# Altium schematic sheet ethernet.SchDoc: Ethernet
size 419 x 297 mm; Address6: Project_Address6; CompanyName: NOT USED; DocumentNumber: 24; SheetNumber: 24; SheetTotal: 29; PageSetup: Record=PageOptions|CenterHorizontal=True|CenterVertical=True|PrintScale=1.00|XCorrection=1.00|YCorrection=1.00|PrintKind=0|BorderSize=5000000|LeftOffset=0|BottomOffset=0|Orientation=2|PaperLength=1000|PaperWidth=1000|Scale=100|PaperSource=7|PrintQuality=-4|MediaType=1|DitherType=10|PaperKind=A3|PrintScaleMode=0
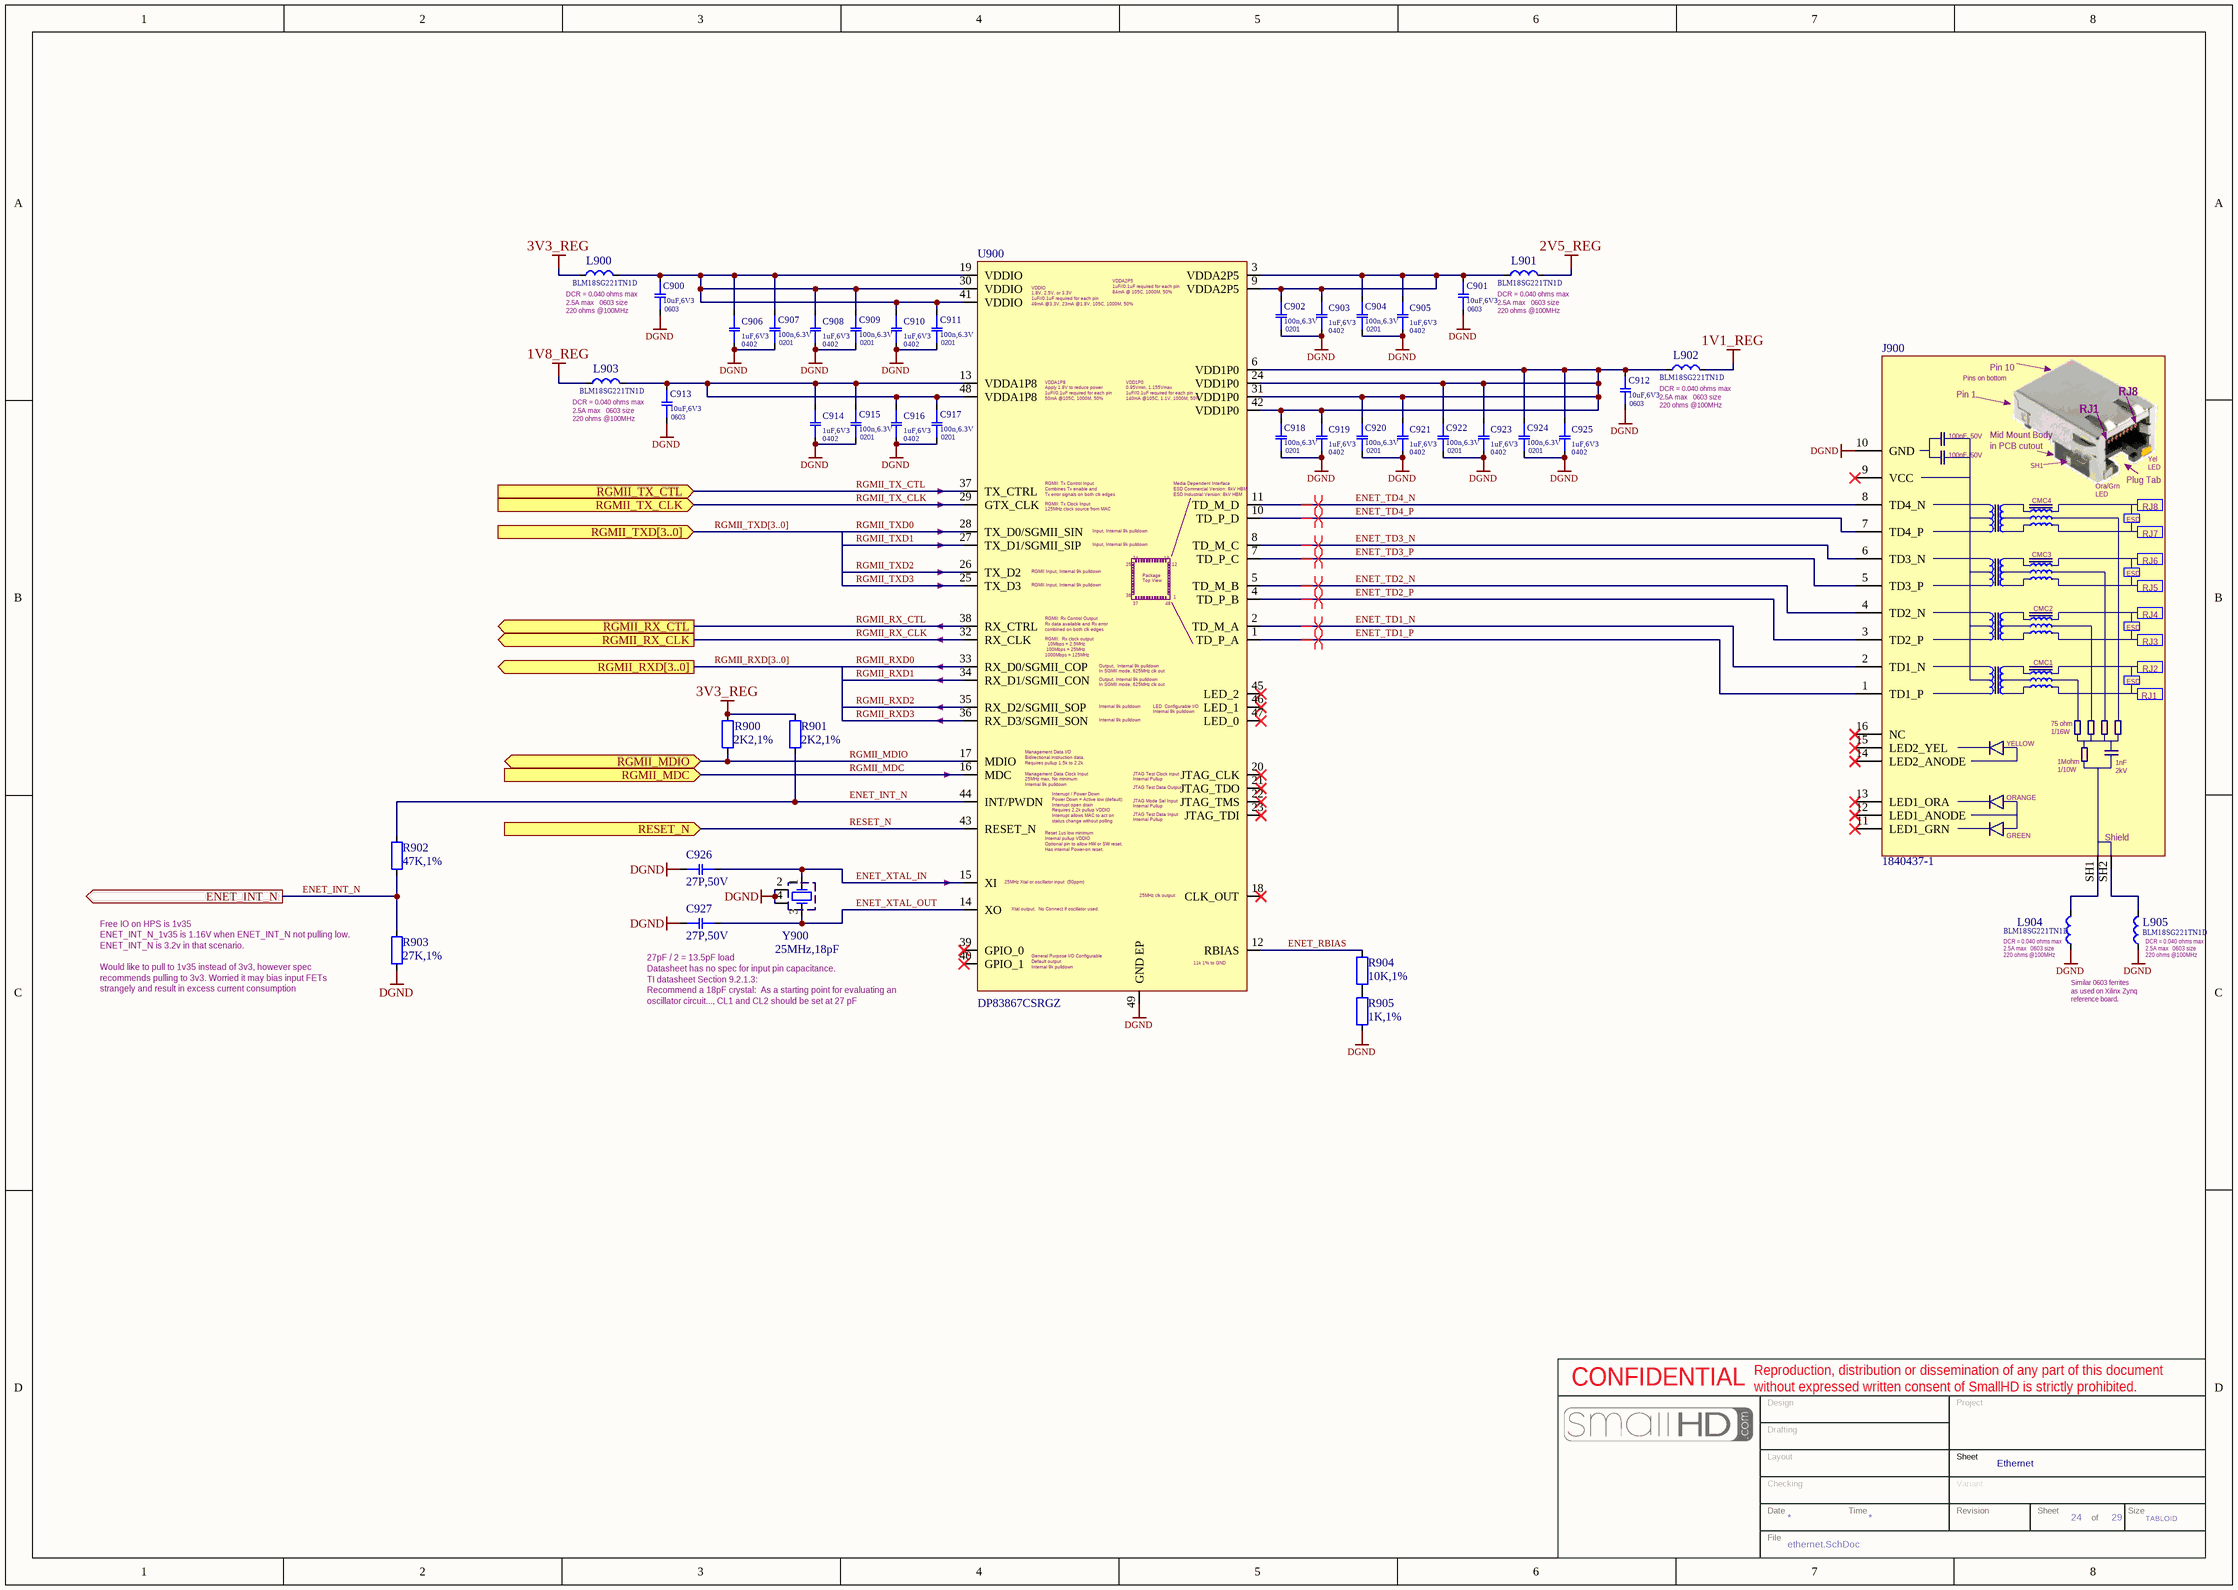
[diagram p0: ethernet.SchDoc]

## Parts
C900  10uF,6V3  Display Footprint: 0603  [CAPC1608X10N_0603]
C901  10uF,6V3  Display Footprint: 0603  [CAPC1608X10N_0603]
C902  100n,6.3V  Display Footprint: 0201  [CAPC0603X03L_0201]
C903  1uF,6V3  Display Footprint: 0402  [CAPC1005X06N_0402]
C904  100n,6.3V  Display Footprint: 0201  [CAPC0603X03L_0201]
C905  1uF,6V3  Display Footprint: 0402  [CAPC1005X06N_0402]
C906  1uF,6V3  Display Footprint: 0402  [CAPC1005X06N_0402]
C907  100n,6.3V  Display Footprint: 0201  [CAPC0603X03L_0201]
C908  1uF,6V3  Display Footprint: 0402  [CAPC1005X06N_0402]
C909  100n,6.3V  Display Footprint: 0201  [CAPC0603X03L_0201]
C910  1uF,6V3  Display Footprint: 0402  [CAPC1005X06N_0402]
C911  100n,6.3V  Display Footprint: 0201  [CAPC0603X03L_0201]
C912  10uF,6V3  Display Footprint: 0603  [CAPC1608X10N_0603]
C913  10uF,6V3  Display Footprint: 0603  [CAPC1608X10N_0603]
C914  1uF,6V3  Display Footprint: 0402  [CAPC1005X06N_0402]
C915  100n,6.3V  Display Footprint: 0201  [CAPC0603X03L_0201]
C916  1uF,6V3  Display Footprint: 0402  [CAPC1005X06N_0402]
C917  100n,6.3V  Display Footprint: 0201  [CAPC0603X03L_0201]
C918  100n,6.3V  Display Footprint: 0201  [CAPC0603X03L_0201]
C919  1uF,6V3  Display Footprint: 0402  [CAPC1005X06N_0402]
C920  100n,6.3V  Display Footprint: 0201  [CAPC0603X03L_0201]
C921  1uF,6V3  Display Footprint: 0402  [CAPC1005X06N_0402]
C922  100n,6.3V  Display Footprint: 0201  [CAPC0603X03L_0201]
C923  1uF,6V3  Display Footprint: 0402  [CAPC1005X06N_0402]
C924  100n,6.3V  Display Footprint: 0201  [CAPC0603X03L_0201]
C925  1uF,6V3  Display Footprint: 0402  [CAPC1005X06N_0402]
C926  27P,50V  [CAPC0603X03L_0201]
C927  27P,50V  [CAPC0603X03L_0201]
J900  1840437-1  [BEL_1840437-1]
L900  BLM18SG221TN1D​  [INDC1608X10N_0603]
L901  BLM18SG221TN1D​  [INDC1608X10N_0603]
L902  BLM18SG221TN1D​  [INDC1608X10N_0603]
L903  BLM18SG221TN1D​  [INDC1608X10N_0603]
L904  BLM18SG221TN1D​  [INDC1608X10N_0603]
L905  BLM18SG221TN1D​  [INDC1608X10N_0603]
R900  2K2,1%  [RESC1005X04N_0402]
R901  2K2,1%  [RESC1005X04N_0402]
R902  47K,1%  [RESC1005X04N_0402]
R903  27K,1%  [RESC1005X04N_0402]
R904  10K,1%  [RESC1005X04N_0402]
R905  1K,1%  [RESC1005X04N_0402]
U900  DP83867CSRGZ  [QFN50P700X700X100_HS-49N]
Y900  25MHz,18pF  [XTAL_ABM8]

## Ports
ENET_INT_N (out), RESET_N (in), RGMII_MDC (in), RGMII_MDIO (bidir), RGMII_RX_CLK (out), RGMII_RX_CTL (out), RGMII_RXD[3..0] (out), RGMII_TX_CLK (in), RGMII_TX_CTL (in), RGMII_TXD[3..0] (in)

## Nets
1V1_REG: L902.2
1V8_REG: L903.1
2V5_REG: L901.2
3V3_REG: L900.1 R900.2 R901.2
DGND: C900.1 C901.1 C902.1 C903.1 C904.1 C905.1 C906.1 C907.1 C908.1 C909.1 C910.1 C911.1 C912.1 C913.1 C914.1 C915.1 C916.1 C917.1 C918.1 C919.1 C920.1 C921.1 C922.1 C923.1 C924.1 C925.1 C926.1 C927.1 J900.10(GND) L904.1 L905.1 R903.1 R905.2 U900.49(GND_EP) Y900.2 Y900.4
ENET_INT_N: R901.1 R902.1 R902.2 R903.2 U900.44(INT/PWDN) ; port ENET_INT_N
ENET_RBIAS: R904.2 U900.12(RBIAS)
ENET_TD1_N: J900.2(TD1_N) U900.2(TD_M_A)
ENET_TD1_P: J900.1(TD1_P) U900.1(TD_P_A)
ENET_TD2_N: J900.4(TD2_N) U900.5(TD_M_B)
ENET_TD2_P: J900.3(TD2_P) U900.4(TD_P_B)
ENET_TD3_N: J900.6(TD3_N) U900.8(TD_M_C)
ENET_TD3_P: J900.5(TD3_P) U900.7(TD_P_C)
ENET_TD4_N: J900.8(TD4_N) U900.11(TD_M_D)
ENET_TD4_P: J900.7(TD4_P) U900.10(TD_P_D)
ENET_XTAL_IN: C926.2 U900.15(XI) Y900.1
ENET_XTAL_OUT: C927.2 U900.14(XO) Y900.3
RESET_N: U900.43(RESET_N) ; port RESET_N
RGMII_MDC: U900.16(MDC) ; port RGMII_MDC
RGMII_MDIO: R900.1 U900.17(MDIO) ; port RGMII_MDIO
RGMII_RX_CLK: U900.32(RX_CLK) ; port RGMII_RX_CLK
RGMII_RX_CTL: U900.38(RX_CTRL) ; port RGMII_RX_CTL
RGMII_RXD0: U900.33(RX_D0/SGMII_COP)
RGMII_RXD1: U900.34(RX_D1/SGMII_CON)
RGMII_RXD2: U900.35(RX_D2/SGMII_SOP)
RGMII_RXD3: U900.36(RX_D3/SGMII_SON)
RGMII_TX_CLK: U900.29(GTX_CLK) ; port RGMII_TX_CLK
RGMII_TX_CTL: U900.37(TX_CTRL) ; port RGMII_TX_CTL
RGMII_TXD0: U900.28(TX_D0/SGMII_SIN)
RGMII_TXD1: U900.27(TX_D1/SGMII_SIP)
RGMII_TXD2: U900.26(TX_D2)
RGMII_TXD3: U900.25(TX_D3)
NetC900_2: C900.2 C906.2 C907.2 C908.2 C909.2 C910.2 C911.2 L900.2 U900.19(VDDIO) U900.30(VDDIO) U900.41(VDDIO)
NetC901_2: C901.2 C902.2 C903.2 C904.2 C905.2 L901.1 U900.3(VDDA2P5) U900.9(VDDA2P5)
NetC912_2: C912.2 C918.2 C919.2 C920.2 C921.2 C922.2 C923.2 C924.2 C925.2 L902.1 U900.6(VDD1P0) U900.24(VDD1P0) U900.31(VDD1P0) U900.42(VDD1P0)
NetC913_2: C913.2 C914.2 C915.2 C916.2 C917.2 L903.2 U900.13(VDDA1P8) U900.48(VDDA1P8)
NetJ900_SH1: J900.SH1(A) L904.2
NetJ900_SH2: J900.SH2(A) L905.2
NetR904_1: R904.1 R905.1

Not connected (* = marked no-connect by the designer): J900 9(VCC)* 11(LED1_GRN)* 12(LED1_ANODE)* 13(LED1_ORA)* 14(LED2_ANODE)* 15(LED2_YEL)* 16(NC)*; U900 18(CLK_OUT)* 20(JTAG_CLK)* 21(JTAG_TDO)* 22(JTAG_TMS)* 23(JTAG_TDI)* 39(GPIO_0)* 40(GPIO_1)* 45(LED_2)* 46(LED_1)* 47(LED_0)*

## Buses and harness runs
bus RGMII_RXD[3..0] = port RGMII_RXD[3..0]
bus RGMII_TXD[3..0] = port RGMII_TXD[3..0]

## Layout directives
differential pair: ENET_TD1_N, ENET_TD1_P, ENET_TD2_N, ENET_TD2_P, ENET_TD3_N, ENET_TD3_P, ENET_TD4_N, ENET_TD4_P

## Notes on the sheet
- DCR = 0.040 ohms max
  2.5A max   0603 size
  220 ohms @100MHz
- (near L901) DCR = 0.040 ohms max
  2.5A max   0603 size
  220 ohms @100MHz
- (near L902) DCR = 0.040 ohms max
  2.5A max   0603 size
  220 ohms @100MHz
- (near L904) DCR = 0.040 ohms max
  2.5A max   0603 size
  220 ohms @100MHz
- Similar 0603 ferrites
  as used on Xilinx Zynq
  reference board.
- (near L905) DCR = 0.040 ohms max
  2.5A max   0603 size
  220 ohms @100MHz
- Free IO on HPS is 1v35
  ENET_INT_N_1v35 is 1.16V when ENET_INT_N not pulling low. ENET_INT_N is 3.2v in that scenario.
  Would like to pull to 1v35 instead of 3v3, however spec recommends pulling to 3v3. Worried it may bias input FETs strangely and result in excess current consumption
- (near C927) 27pF / 2 = 13.5pF load
  Datasheet has no spec for input pin capacitance.
  TI datasheet Section 9.2.1.3:
  Recommend a 18pF crystal:  As a starting point for evaluating an oscillator circuit..., CL1 and CL2 should be set at 27 pF
- CONFIDENTIAL
- Reproduction, distribution or dissemination of any part of this document without expressed written consent of SmallHD is strictly prohibited.
- Design
- Project
- Drafting
- Layout
- Sheet
- Date
- File
- Checking
- Time
- Variant
- Revision
- of
- Size
- TABLOID
- (in symbol 119) Pin 10; Pins on bottom; Pin 1; RJ8; RJ1; 100nF, 50V; Mid Mount Body / in PCB cutout; Yel / LED; Plug Tab; Ora/Grn / LED; CMC4; ESD; RJ7; CMC3; RJ6; RJ5; CMC2; RJ4; RJ3; CMC1; RJ2; 75 ohm / 1/16W; YELLOW; 1Mohm / 1/10W; 1nF / 2kV; ORANGE; GREEN; Shield
- (in symbol ICT-20164-101) VDDA2P5 / 1uF//0.1uF required for each pin / 84mA @ 105C, 1000M, 50%; VDDIO / 1.8V, 2.5V, or 3.3V / 1uF//0.1uF required for each pin / 49mA @3.3V, 23mA @1.8V, 105C, 1000M, 50%; VDDA1P8 / Apply 1.8V to reduce power / 1uF//0.1uF required for each pin / 50mA @105C, 1000M, 50%; VDD1P0 / 0.95Vmin, 1.155Vmax / 1uF//0.1uF required for each pin / 140mA @105C, 1.1V, 1000M, 50%; RGMII: Tx Control Input / Combines Tx enable and / Tx error signals on both clk edges; Media Dependent Interface / ESD Commercial Version: 6kV HBM / ESD Industrial Version: 8kV HBM; RGMII: Tx Clock Input / 125MHz clock source from MAC; Input, Internal 9k pulldown; RGMII Input, Internal 9k pulldown; Package / Top View; RGMII: Rx Control Output / Rx data available and Rx error / combined on both clk edges; RGMII:  Rx clock output / 10Mbps = 2.5MHz / 100Mbps = 25MHz / 1000Mbps = 125MHz; Output,  Internal 9k pulldown / In SGMII mode, 625MHz clk out; Output, Internal 9k pulldown / In SGMII mode, 625MHz clk out; Internal 9k pulldown; LED  Configurable I/O / Internal 9k pulldown; Management Data I/O / Bidirectional instruction data. / Requires pullup 1.5k to 2.2k; JTAG Test Clock input / Internal Pullup; Management Data Clock Input / 25MHz max, No minimum / Internal 9k pulldown; JTAG Test Data Output; JTAG Mode Sel Input / Internal Pullup; JTAG Test Data Input / Internal Pullup; Interrupt / Power Down / Power Down = Active low (default) / Interrupt open drain / Requires 2.2k pullup VDDIO / Interrupt allows MAC to act on / status change without polling; Reset 1us low minimum / Internal pullup VDDIO / Optional pin to allow HW or SW reset. / Has internal Power-on reset.; 25MHz Xtal or oscillator input  (50ppm); 25MHz clk output; Xtal output.  No Connect if oscillator used.; General Purpose I/O Configurable / Default output / Internal 9k pulldown; 11k 1% to GND

## Library data of the parts
C900 C901 C912 C913 = CAP-20026-101: CAP CER 10UF 6.3V 20% X5R 0603; Manufacturer: TDK; Manufacturer Part Number: C1608X5R0J106M080AB; Manufacturer-2 Part Number: GRM188R60J106ME47J; Capacitance: 0.1uF; Type: Ceramic; Display_Name: 10uF,6V3; Dielectric: X5R; Tolerance: 20%; Voltage: 6.3V; Schematic Symbol: CAP-NP_1; smallHD PN: CAP-20026-101; Manufacturer-2: Murata
C902 C904 C907 C909 C911 C915 C917 C918 C920 C922 C924 = CAP-20025-101: CAP CER 0.1UF 6.3V 20% X5R 0201; Manufacturer: TDK; Manufacturer Part Number: C0603X5R0J104M030BC; Manufacturer-2 Part Number: GRM033R60J104ME19D; Type: Ceramic; Display_Name: 100n,6.3V; Capacitance: 0.1uF; Dielectric: X5R; Tolerance: 20%; Voltage: 6.3V; Schematic Symbol: CAP-NP_1; smallHD PN: CAP-20025-101; Manufacturer-2: Murata
C903 C905 C906 C908 C910 C914 C916 C919 C921 C923 C925 = CAP-20023-101: CAP CER 1UF 6.3V 10% X5R 0402; Manufacturer: AVX; Manufacturer Part Number: 04026D105KAT2A; Manufacturer-2 Part Number: GRM155R60J105KE19D; Capacitance: 1.0uF; Type: Ceramic; Display_Name: 1uF,6V3; Dielectric: X5R; Tolerance: 10%; Voltage: 6.3V; Schematic Symbol: CAP-NP_1; smallHD PN: CAP-20023-101; Thickness (Max): 0.56mm; Manufacturer-2: Murata
C926 C927 = CAP-20048-001: CAP CER 27PF 50V 5% NPO 0201; Manufacturer: Murata; Manufacturer Part Number: GRM0335C1H270JA01D; Type: Ceramic; Display Footprint: 0201; Display_Name: 27P,50V; Capacitance: 27PF; Dielectric: NPO; Tolerance: 5%; Voltage: 50V; Schematic Symbol: CAP-NP_1; smallHD PN: CAP-20048-001; Thickness (Max): 0.33mm
J900 = 119: CONN RJ45 MAGJACK 1PORT 1000 BASE-T; Manufacturer: Bel Fuse, Inc.; Contacts: 16; Index: 119; smallHD PN: CON-20118-001; Display_Name: 1840437-1; Series: MagJack; Type: Receptacle; Manufacturer Part Number: 1840437-1; Display Footprint: 1840437-1
L900-L905 = IND-20022-001: FERRITE CHIP 220 OHM 2.5A 0603; Manufacturer: Murata; DC Resistance: 40mOhm; Display Footprint: 0603; Display_Name: BLM18SG221TN1D​; Current Rating: 2.5A; Schematic Symbol: INDUCTOR_1; smallHD PN: IND-20022-001; Manufacturer Part Number: BLM18SG221TN1D​
R900 R901 = RES-20049-101: RES SMD 2.2K OHM 1/16W 1% 0402; Manufacturer: Yageo; Manufacturer Part Number: RC0402FR-072K2L; Manufacturer-2 Part Number: RK73H1ETTP2201F; Power: 0.0625W; Display Footprint: 0402; Display_Name: 2K2,1%; Resistance: 2K2; Tolerance: 1%; Type: Chip; Manufacturer-2: Koa Speer Electronics; Schematic Symbol: RESISTOR_1; smallHD PN: RES-20049-101
R902 = RES-20054-101: RES SMD 47K OHM 1/16W 1% 0402; Manufacturer: Yageo; Manufacturer Part Number: RC0402FR-0747KL; Manufacturer-2 Part Number: RK73H1ETTP4702F; Power: 0.0625W; Display Footprint: 0402; Display_Name: 47K,1%; Resistance: 47K; Tolerance: 1%; Type: Chip; Schematic Symbol: RESISTOR_1; Manufacturer-2: Koa Speer Electronics; smallHD PN: RES-20054-101
R903 = RES-20053-101: RES SMD 27K OHM 1/16W 1% 0402; Manufacturer: Yageo; Manufacturer Part Number: RC0402FR-0727KL; Manufacturer-2 Part Number: RK73H1ETTP2702F; Power: 0.0625W; Display Footprint: 0402; Display_Name: 27K,1%; Resistance: 27K; Tolerance: 1%; Type: Chip; Schematic Symbol: RESISTOR_1; Manufacturer-2: Koa Speer Electronics; smallHD PN: RES-20053-101
R904 = RES-20052-101: RES SMD 10K OHM 1/16W 1% 0402; Manufacturer: Yageo; Manufacturer Part Number: RC0402FR-0710KL; Manufacturer-2 Part Number: RK73H1ETTP1002F; Power: 0.0625W; Display Footprint: 0402; Display_Name: 10K,1%; Resistance: 10K; Tolerance: 1%; Type: Chip; Manufacturer-2: Koa Speer Electronics; Schematic Symbol: RESISTOR_1; smallHD PN: RES-20052-101
R905 = RES-20047-101: RES SMD 1K OHM 1/16W 1% 0402; Manufacturer: Yageo; Manufacturer Part Number: RC0402FR-071KL; Manufacturer-2 Part Number: RK73H1ETTP1001F; Power: 0.0625W; Display Footprint: 0402; Display_Name: 1K,1%; Resistance: 1K; Tolerance: 1%; Type: Chip; Manufacturer-2: Koa Speer Electronics; Schematic Symbol: RESISTOR_1; smallHD PN: RES-20047-101
U900 = ICT-20164-101: IC ETHERNET PHY 10/100/1000 RGMII SGMII 48VQFN; Manufacturer: Texas Instruments; Manufacturer-2 Part Number: DP83867ISRGZ; Temp Range: 0°C ~70°C; Display Footprint: QFN48; Display_Name: DP83867CSRGZ; Schematic Symbol: DP83867CS; smallHD PN: ICT-20164-101; Manufacturer Part Number: DP83867CSRGZ; Manufacturer-2: Texas Instruments
Y900 = XTL-20005-001: CRYSTAL 25.000MHZ 18PF SMD; Manufacturer: Abracon Corporation; Manufacturer Part Number: ABM8-25.000MHZ-B2-T; Accuracy: ±20ppm; Display Footprint: ABM8; esr_max: 50Ohms; Display_Name: 25MHz,18pF; Frequency: 25MHz; Type: Fundamental; Load Capacitance: 18pF; Schematic Symbol: XTAL_2; smallHD PN: XTL-20005-001